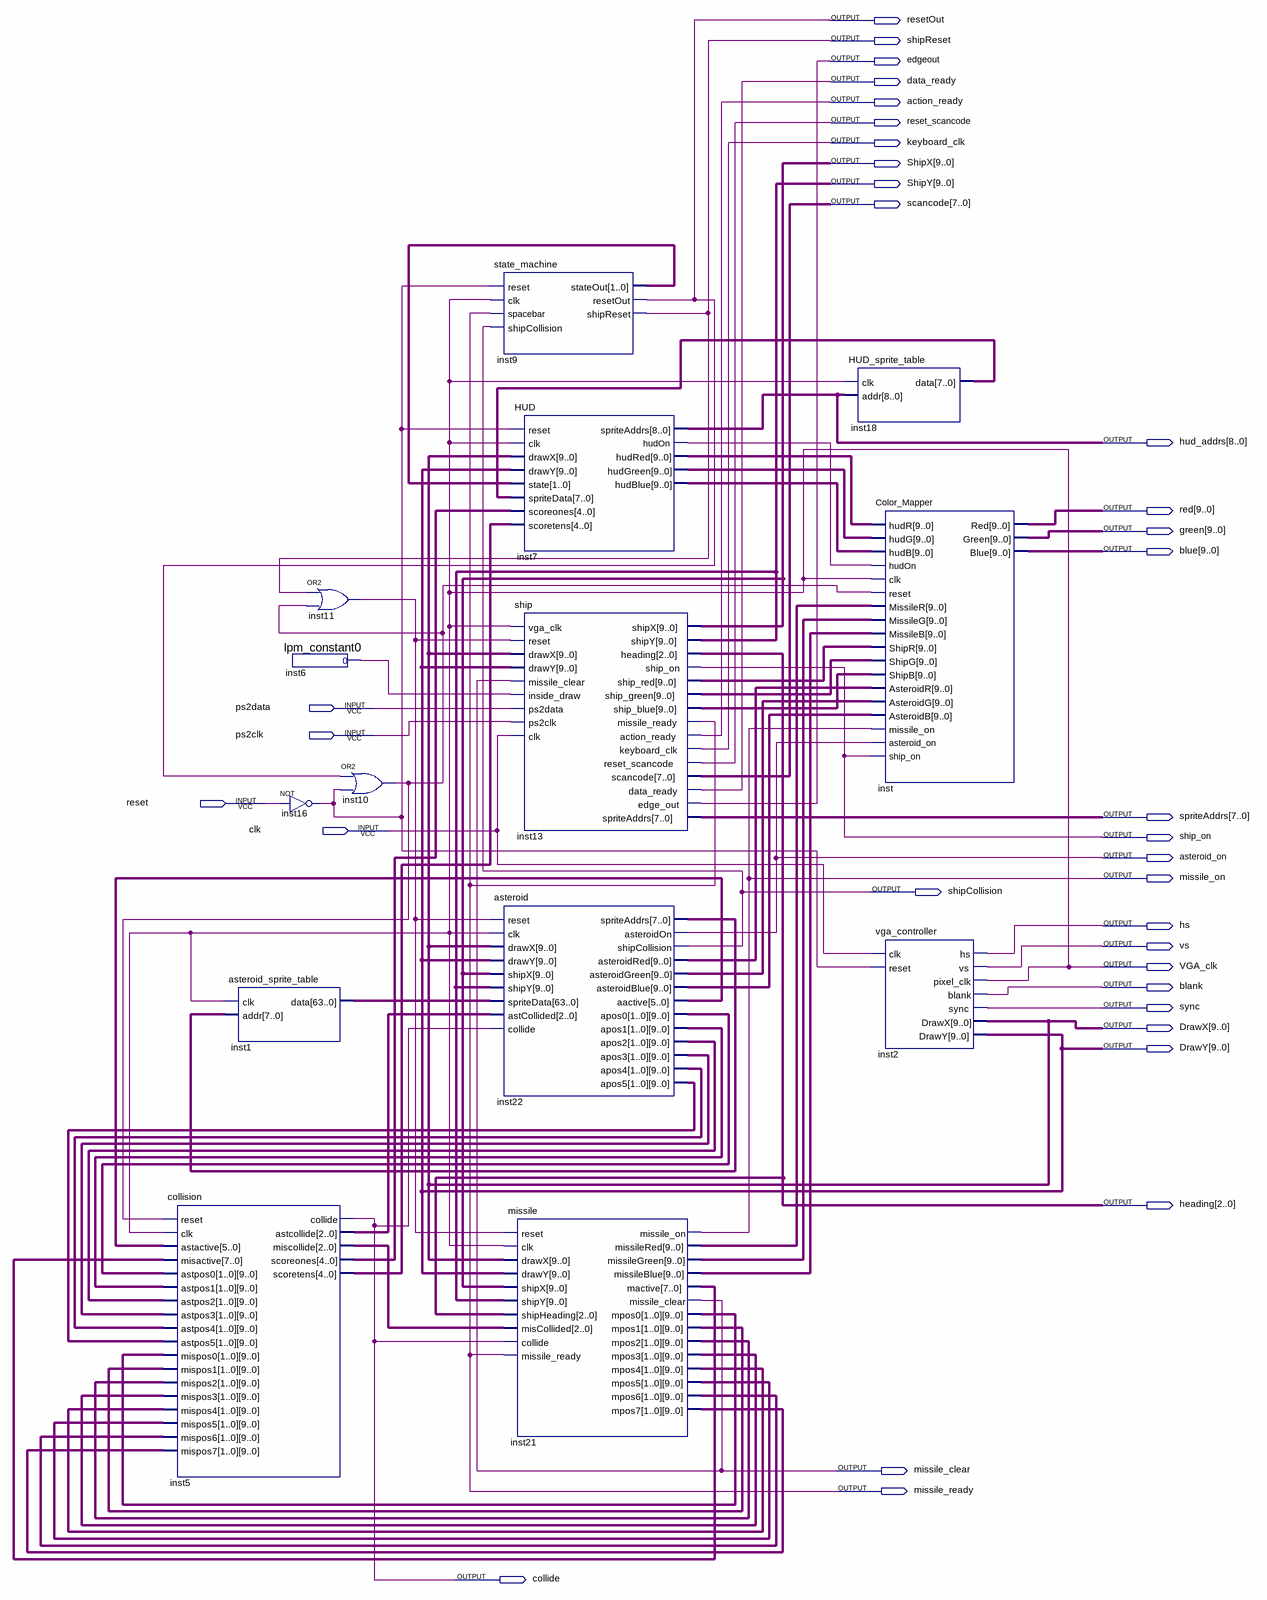
[diagram p0: schematic sheet]
// Quartus schematic asteroids.bdf as structural Verilog: 14 symbols, 34 pins
module asteroids (
  input  ps2data,
  input  ps2clk,
  input  reset,
  input  clk,
  output resetOut,
  output shipReset,
  output edgeout,
  output data_ready,
  output action_ready,
  output reset_scancode,
  output keyboard_clk,
  output [9:0] ShipX,
  output [9:0] ShipY,
  output [7:0] scancode,
  output [8:0] hud_addrs,
  output [9:0] red,
  output [9:0] green,
  output [9:0] blue,
  output [7:0] spriteAddrs,
  output ship_on,
  output asteroid_on,
  output missile_on,
  output shipCollision,
  output hs,
  output vs,
  output VGA_clk,
  output blank,
  output sync,
  output [9:0] DrawX,
  output [9:0] DrawY,
  output [2:0] heading,
  output missile_clear,
  output missile_ready,
  output collide
);

  wire inst6_result, inst7_hudon, inst10_out, inst11_out, inst16_out;
  wire [1:0] inst9_stateout;
  wire [2:0] inst5_astcollide, inst5_miscollide;
  wire [4:0] inst5_scoreones, inst5_scoretens;
  wire [5:0] inst22_aactive;
  wire [7:0] inst18_data, inst21_mactive, inst22_spriteaddrs;
  wire [9:0] inst7_hudblue, inst7_hudgreen, inst7_hudred, inst13_ship_blue, inst13_ship_green,
       inst13_ship_red, inst21_missileblue, inst21_missilegreen, inst21_missilered, inst22_asteroidblue,
       inst22_asteroidgreen, inst22_asteroidred;
  wire [19:0] inst21_mpos0, inst21_mpos1, inst21_mpos2, inst21_mpos3, inst21_mpos4, inst21_mpos5,
       inst21_mpos6, inst21_mpos7, inst22_apos0, inst22_apos1, inst22_apos2, inst22_apos3, inst22_apos4,
       inst22_apos5;
  wire [63:0] inst1_data;

  collision inst5 (
    .reset(inst10_out), .clk(VGA_clk), .astactive(inst22_aactive), .misactive(inst21_mactive),
    .astpos0(inst22_apos0), .astpos1(inst22_apos1), .astpos2(inst22_apos2), .astpos3(inst22_apos3),
    .astpos4(inst22_apos4), .astpos5(inst22_apos5), .mispos0(inst21_mpos0), .mispos1(inst21_mpos1),
    .mispos2(inst21_mpos2), .mispos3(inst21_mpos3), .mispos4(inst21_mpos4), .mispos5(inst21_mpos5),
    .mispos6(inst21_mpos6), .mispos7(inst21_mpos7), .collide(collide), .astcollide(inst5_astcollide),
    .miscollide(inst5_miscollide), .scoreones(inst5_scoreones), .scoretens(inst5_scoretens));
  asteroid_sprite_table inst1 (.clk(VGA_clk), .addr(inst22_spriteaddrs), .data(inst1_data));
  lpm_constant0 inst6 (.result(inst6_result));
  not inst16 (inst16_out, reset);
  or inst11 (inst11_out, shipReset, inst10_out);
  or inst10 (inst10_out, resetOut, inst16_out);
  state_machine inst9 (
    .reset(inst16_out), .clk(VGA_clk), .spacebar(missile_ready), .shipCollision(shipCollision),
    .stateOut(inst9_stateout), .resetOut(resetOut), .shipReset(shipReset));
  HUD inst7 (
    .reset(inst16_out), .clk(VGA_clk), .drawX(DrawX), .drawY(DrawY), .state(inst9_stateout),
    .spriteData(inst18_data), .scoreones(inst5_scoreones), .scoretens(inst5_scoretens),
    .spriteAddrs(hud_addrs), .hudOn(inst7_hudon), .hudRed(inst7_hudred), .hudGreen(inst7_hudgreen),
    .hudBlue(inst7_hudblue));
  ship inst13 (
    .vga_clk(VGA_clk), .reset(inst11_out), .drawX(DrawX), .drawY(DrawY), .missile_clear(missile_clear),
    .inside_draw(inst6_result), .ps2data(ps2data), .ps2clk(ps2clk), .clk(clk), .shipX(ShipX), .shipY(ShipY),
    .heading(heading), .ship_on(ship_on), .ship_red(inst13_ship_red), .ship_green(inst13_ship_green),
    .ship_blue(inst13_ship_blue), .missile_ready(missile_ready), .action_ready(action_ready),
    .keyboard_clk(keyboard_clk), .reset_scancode(reset_scancode), .scancode(scancode),
    .data_ready(data_ready), .edge_out(edgeout), .spriteAddrs(spriteAddrs));
  asteroid inst22 (
    .reset(inst11_out), .clk(VGA_clk), .drawX(DrawX), .drawY(DrawY), .shipX(ShipX), .shipY(ShipY),
    .spriteData(inst1_data), .astCollided(inst5_astcollide), .collide(collide),
    .spriteAddrs(inst22_spriteaddrs), .asteroidOn(asteroid_on), .shipCollision(shipCollision),
    .asteroidRed(inst22_asteroidred), .asteroidGreen(inst22_asteroidgreen),
    .asteroidBlue(inst22_asteroidblue), .aactive(inst22_aactive), .apos0(inst22_apos0), .apos1(inst22_apos1),
    .apos2(inst22_apos2), .apos3(inst22_apos3), .apos4(inst22_apos4), .apos5(inst22_apos5));
  missile inst21 (
    .reset(inst11_out), .clk(VGA_clk), .drawX(DrawX), .drawY(DrawY), .shipX(ShipX), .shipY(ShipY),
    .shipHeading(heading), .misCollided(inst5_miscollide), .collide(collide), .missile_ready(missile_ready),
    .missile_on(missile_on), .missileRed(inst21_missilered), .missileGreen(inst21_missilegreen),
    .missileBlue(inst21_missileblue), .mactive(inst21_mactive), .missile_clear(missile_clear),
    .mpos0(inst21_mpos0), .mpos1(inst21_mpos1), .mpos2(inst21_mpos2), .mpos3(inst21_mpos3),
    .mpos4(inst21_mpos4), .mpos5(inst21_mpos5), .mpos6(inst21_mpos6), .mpos7(inst21_mpos7));
  HUD_sprite_table inst18 (.clk(VGA_clk), .addr(hud_addrs), .data(inst18_data));
  Color_Mapper inst (
    .hudR(inst7_hudred), .hudG(inst7_hudgreen), .hudB(inst7_hudblue), .hudOn(inst7_hudon), .clk(VGA_clk),
    .reset(inst10_out), .MissileR(inst21_missilered), .MissileG(inst21_missilegreen),
    .MissileB(inst21_missileblue), .ShipR(inst13_ship_red), .ShipG(inst13_ship_green),
    .ShipB(inst13_ship_blue), .AsteroidR(inst22_asteroidred), .AsteroidG(inst22_asteroidgreen),
    .AsteroidB(inst22_asteroidblue), .missile_on(missile_on), .asteroid_on(asteroid_on), .ship_on(ship_on),
    .Red(red), .Green(green), .Blue(blue));
  vga_controller inst2 (
    .clk(clk), .reset(inst16_out), .hs(hs), .vs(vs), .pixel_clk(VGA_clk), .blank(blank), .sync(sync),
    .DrawX(DrawX), .DrawY(DrawY));
endmodule
